# EAGLE design TubeScreamer (EAGLE 9.5.2)
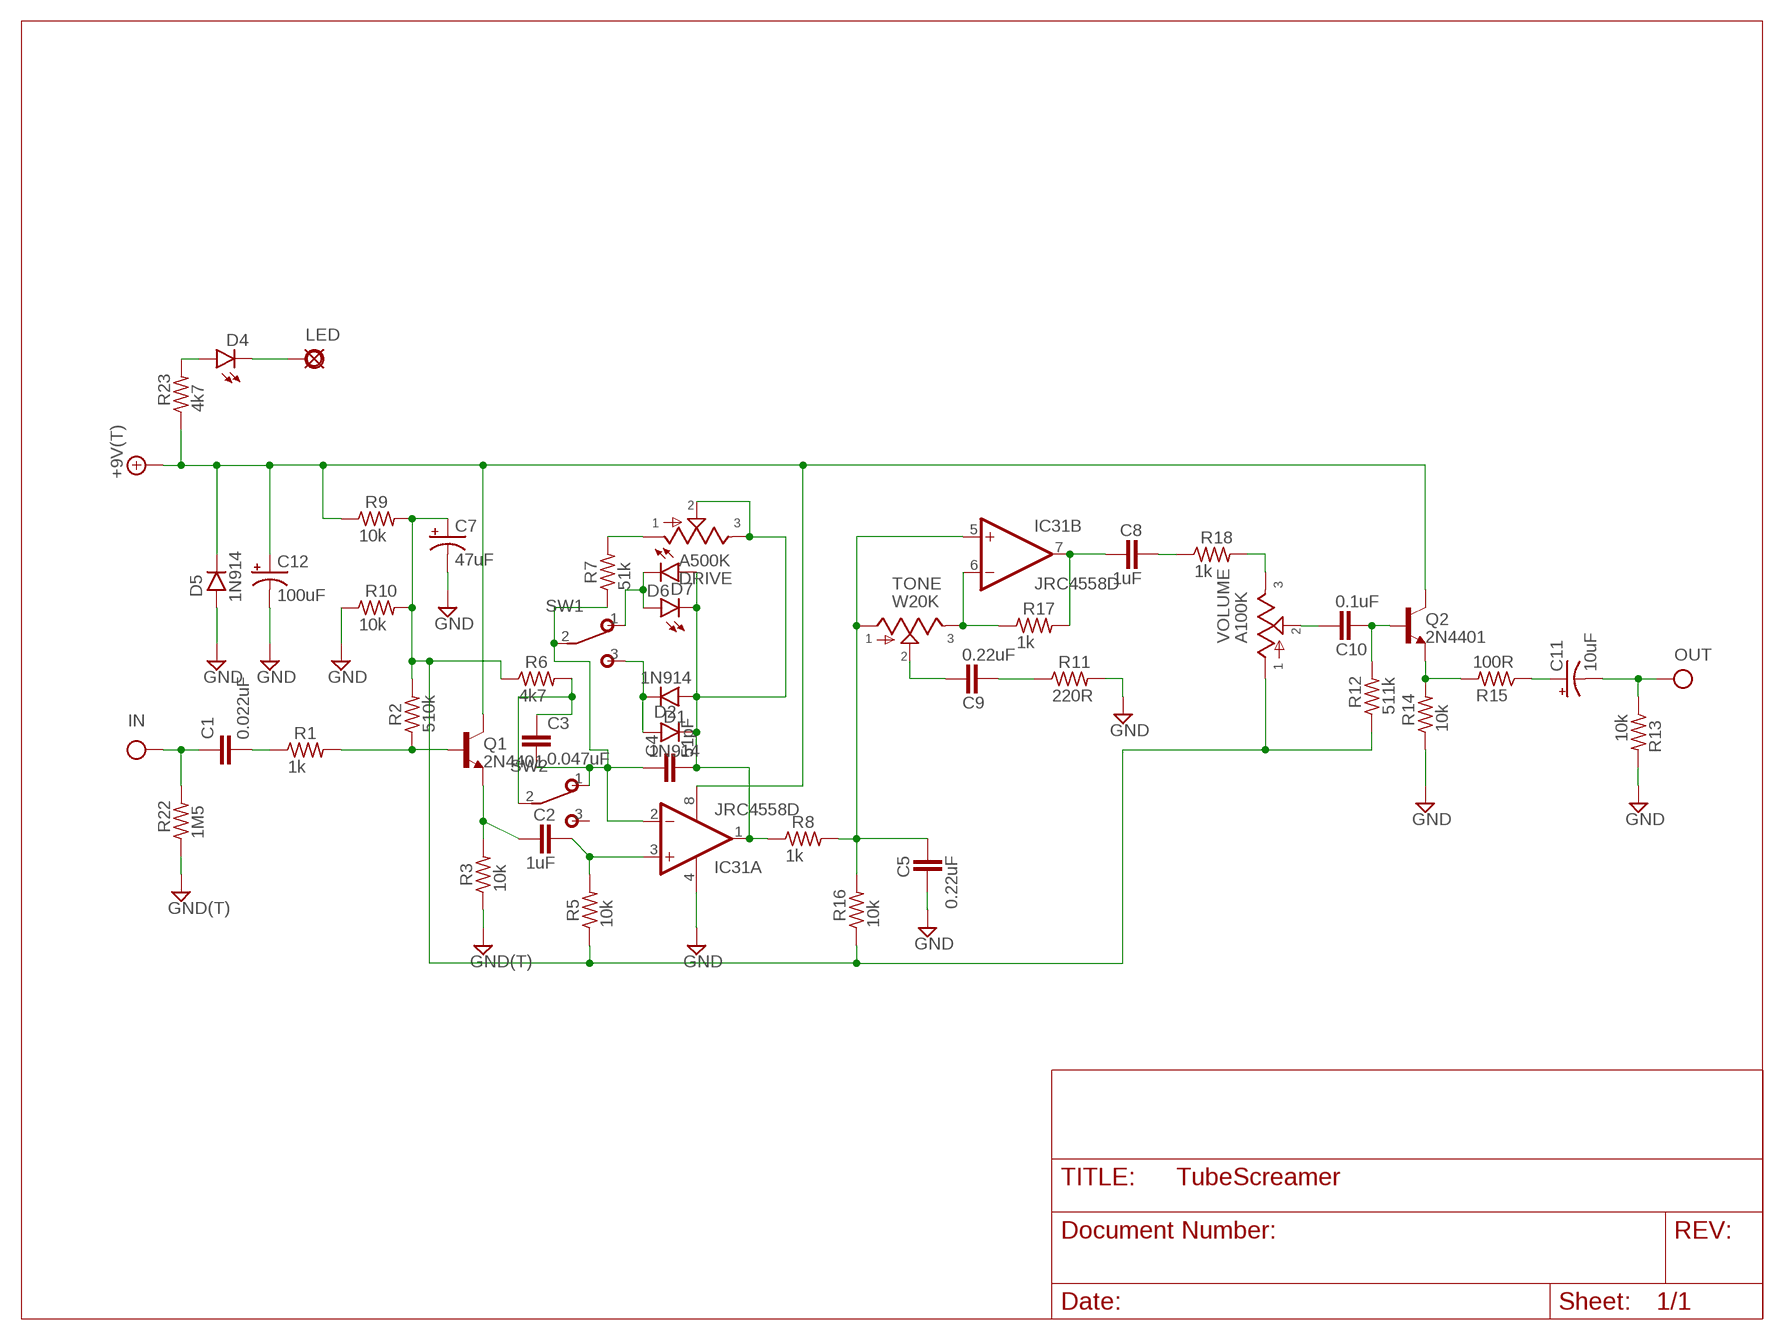
[diagram p0: schematic, sheet 1]

## Parts
+9V  +9V(T)  [SQUARE]
C1  0.022uF  070X0302  [070X030]
C2  1uF  072X0352  [072X035]
C3  0.047uF  070X0302  [070X030]
C4  51pF  050X030_0251  [050X030_025]
C5  0.22uF  072X0352  [072X035]
C7  47uF  0631  [063_025]
C8  1uF  072X0352  [072X035]
C9  0.22uF  072X0352  [072X035]
C10  0.1uF  072X0352  [072X035]
C11  10uF  0631  [063_025]
C12  100uF  080  [080_035]
D1  1N914  1N914.3  [DO35-3]
D2  1N914  1N914.3  [DO35-3]
D4  LED3MM  [LED3MM]
D5  1N914  1N914.3  [DO35-3]
D6  LED3MM  [LED3MM]
D7  LED3MM  [LED3MM]
DRIVE  A500K  POT16MM  [16MM]
GD2  GND(T)  [SQUARE]
GND  GND(T)  [SQUARE]
IC31  JRC4558D  LM4558N  [DIL08]
IN  IN(T)  [SQUARE]
LED  3mm  PAD  [SQUARE]
OUT  OUT(T)  [SQUARE]
Q1  2N4401  2N3904  [TO92-]
Q2  2N4401  2N3904  [TO92-]
R1  1k  6MM.3  [R0207/3]
R2  510k  6MM.3  [R0207/3]
R3  10k  6MM.3  [R0207/3]
R5  10k  6MM.3  [R0207/3]
R6  4k7  6MM.3  [R0207/3]
R7  51k  6MM.3  [R0207/3]
R8  1k  6MM.3  [R0207/3]
R9  10k  6MM.3  [R0207/3]
R10  10k  6MM.3  [R0207/3]
R11  220R  6MM.3  [R0207/3]
R12  511k  6MM.3  [R0207/3]
R13  10k  6MM.3  [R0207/3]
R14  10k  6MM.3  [R0207/3]
R15  100R  6MM.3  [R0207/3]
R16  10k  6MM.3  [R0207/3]
R17  1k  6MM.3  [R0207/3]
R18  1k  6MM.3  [R0207/3]
R22  1M5  6MM.3  [R0207/3]
R23  4k7  6MM.3  [R0207/3]
SW1  DIODES  SPDT  [M9040P]
SW2  FAT  SPDT  [M9040P]
TONE  W20K  POT16MM  [16MM]
VOLUME  A100K  POT16MM  [16MM]

## Nets
+9V: +9V.1(+9V) C12.+ D5.C IC31.8(P:V+) Q1.1(C) Q2.1(C) R9.1 R23.1
GND: C5.1 C7.- C12.- D5.A GD2.1(GND) GND.1(GND) IC31.4(P:V-) R3.1 R10.1 R11.2 R13.2 R14.1 R22.1
IN: C1.1 IN.1(IN) R22.2
N$1: C1.2 R1.1
N$2: Q1.2(B) R1.2 R2.1
N$3: D4.A R23.2
N$4: C2.1 Q1.3(E) R3.2
N$5: C7.+ R2.2 R5.1 R6.1 R9.2 R10.2 R12.1 R16.1 VOLUME.1
N$6: C2.2 IC31.3(A:+IN) R5.2
N$7: C4.2 D1.A D2.C D6.A D7.K(C) DRIVE.2 DRIVE.3 IC31.1(A:OUT) R8.1
N$8: C3.1 R6.2 SW2.2(P)
N$9: DRIVE.1 R7.2
N$10: C3.2 C4.1 IC31.2(A:-IN) R7.1 SW1.2(P) SW2.1(O)
N$11: C9.2 TONE.2
N$12: C5.2 IC31.5(B:+IN) R8.2 R16.2 TONE.1
N$13: C9.1 R11.1
N$14: IC31.6(B:-IN) R17.1 TONE.3
N$15: C8.1 IC31.7(B:OUT) R17.2
N$16: C8.2 R18.1
N$17: R18.2 VOLUME.3
N$18: C10.2 VOLUME.2
N$19: C10.1 Q2.2(B) R12.2
N$20: Q2.3(E) R14.2 R15.2
N$21: C11.+ R15.1
N$22: D4.K(C) LED.1(PAD)
N$24: D1.C D2.A SW1.3(S)
N$27: D6.K(C) D7.A SW1.1(O)
OUT: C11.- OUT.1(OUT) R13.1
Unconnected: SW2.3(S)

## Library data of the parts
+9V = mb_supply:+9V(T): +9V Voltage Supply use this to hook up +9v throughout a schematic instead of running wire automatically labels the net "+9v" adds a hookup pad to the circuit board
C1 C3 = mb_caps-chicklet:070X030: 0.0001 - .01uF (100 - 10,000pF) Panasonic ECQ-B 7mm x 3mm 50 or 63V: 0.0001 - .01uF (100 - 10,000pF);
C2 C5 C8-C10 = mb_caps-box:072X035: 0.15 - 1.0uF; WIMA MKP2 63, 100V: 0.047uF; MKS2 50V: 0.68 - 1.0uF; 63V: 0.33 - 0.47uF; 100V: 0.15 - 0.22uF;
C4 = mb_caps-ceramic:050X030_025: 47 - 120pF Xicon Ceramic Disc 2.5mm lead spacing
C7 C11 = mb_caps-electro:063: 33 - 220uF Xicon values at Mouser.com 10V: 220uF; 16V: 100uF; 25V: 100uF; 50V: 33uF
C12 = mb_caps-electro:080: 47 - 470uF Xicon values at Mouser.com 10V: 330, 470uF; 16V: 220, 330uF; 25V: 220uF; 50V: 47, 100uF
D1 D2 D5 = mb_diodes:1N914: Fast Switching Diode DO-35 glass case a.k.a. 1N4148
D4 D6 D7 = mb_diodes:LED
DRIVE TONE VOLUME = mb_pots:POT: Potentiometers the arrow indicates the clockwise motion of th wiper (lug 2) fully counter clockwise there is no resistance between lugs 1 and 2 fully clockwise the resistance between lugs 1 and 2 is the value of the pot
GD2 GND = mb_supply:GND(T): Ground use this to hook up ground (GND) throughout a schematic instead of running wire automatically labels the net "GND" adds a hookup pad to the circuit board (you can use several)
IC31 = mb_ics:*4558: *4558 Op Amp Infamous for its use in tube screamers. This op amp has many manufacturers, hence the leading "*" in the name. The JRC4558 is a widely used example.
IN = mb_supply:IN(T): Input obsolete: use Pad instead and label net shematic input label with circuit board terminal/pad generally used only once on a schematic (because this device labels the net "IN" in the same way as a voltage supply or ground net)
LED = mb_supply:PAD: PAD use this package for pads with any purpose, including input, output, send or return various pad shapes: round, square, octogonal, long, and long offset
OUT = mb_supply:OUT(T): Output obsolete: use Pad instead and label net output label with circuit board terminal/pad usually appears only once on a schematic
Q1 Q2 = mb_trans:2N3904: NPN Transistor
R1-R3 R5-R18 R22 R23 = mb_resistors:6MM: 6mm Resistors Leads spaced 1-6 holes apart for 0.1" perfboard. Suitable for 1/4 watt resistors.
SW1 SW2 = mb_switches:SPDT: TOGGLE SWITCH Marquardt

## Board
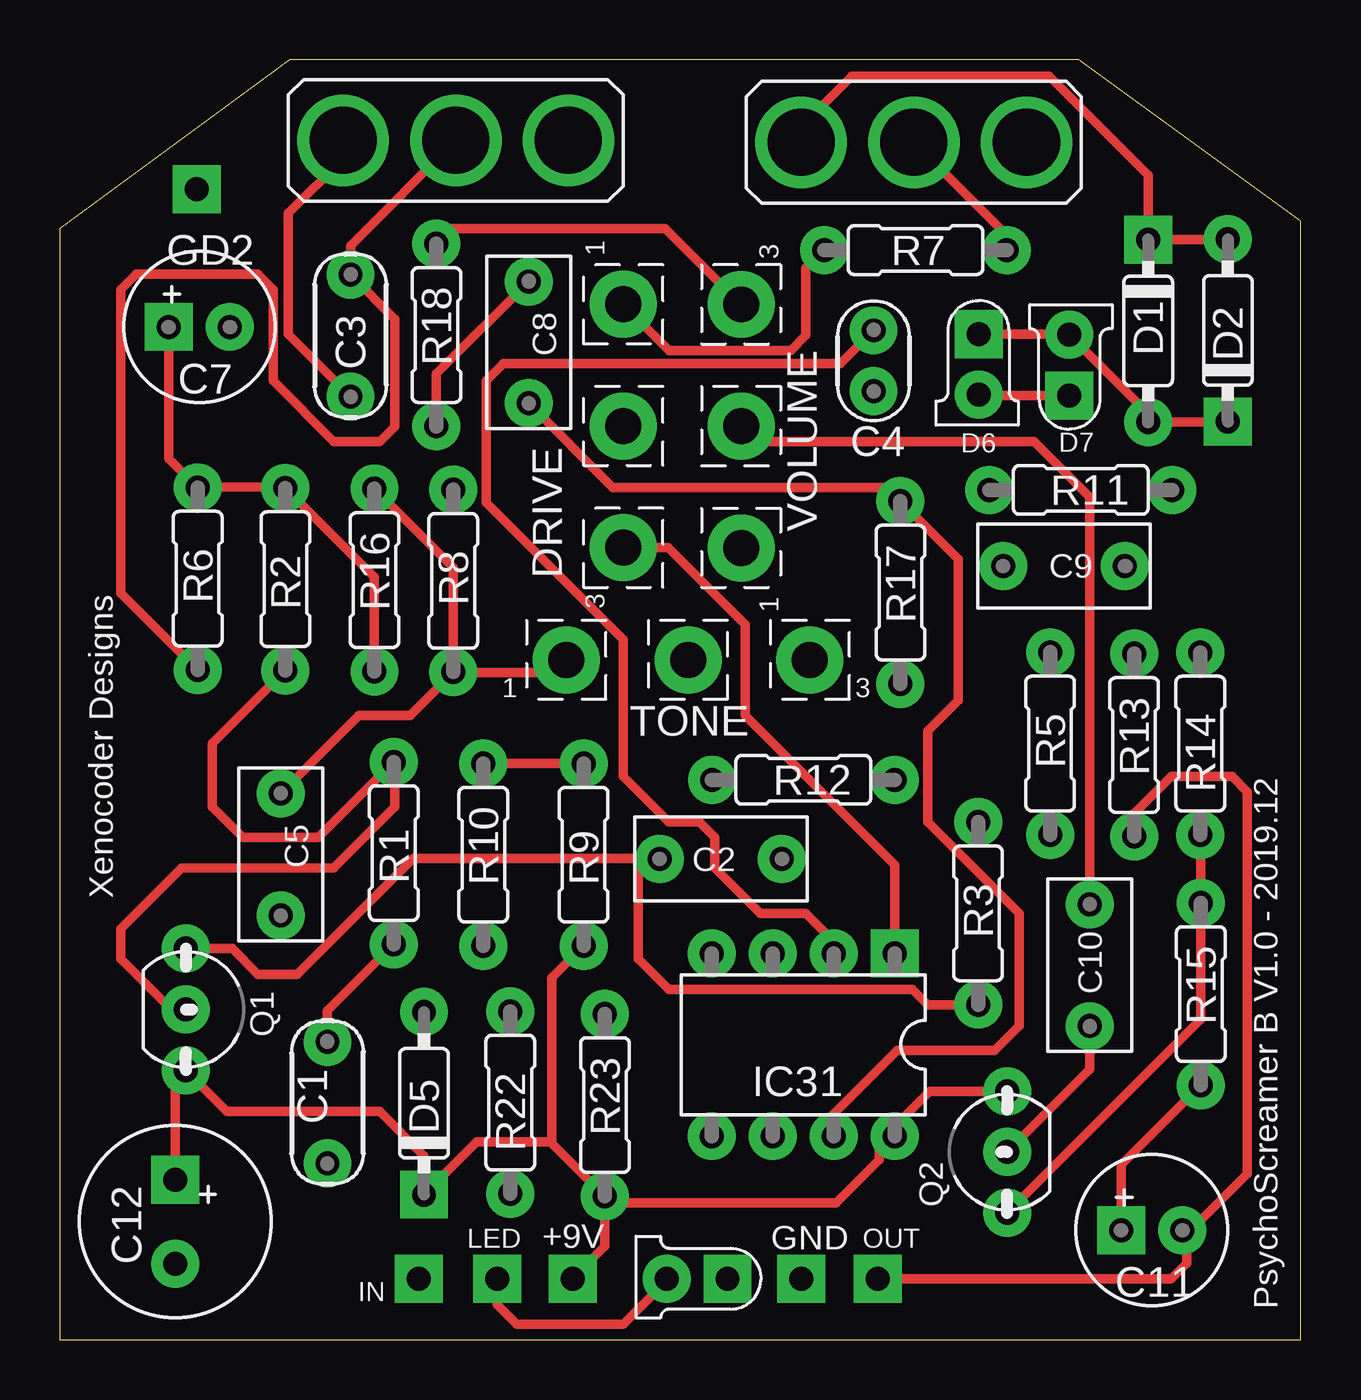
[diagram p1: board, top side]
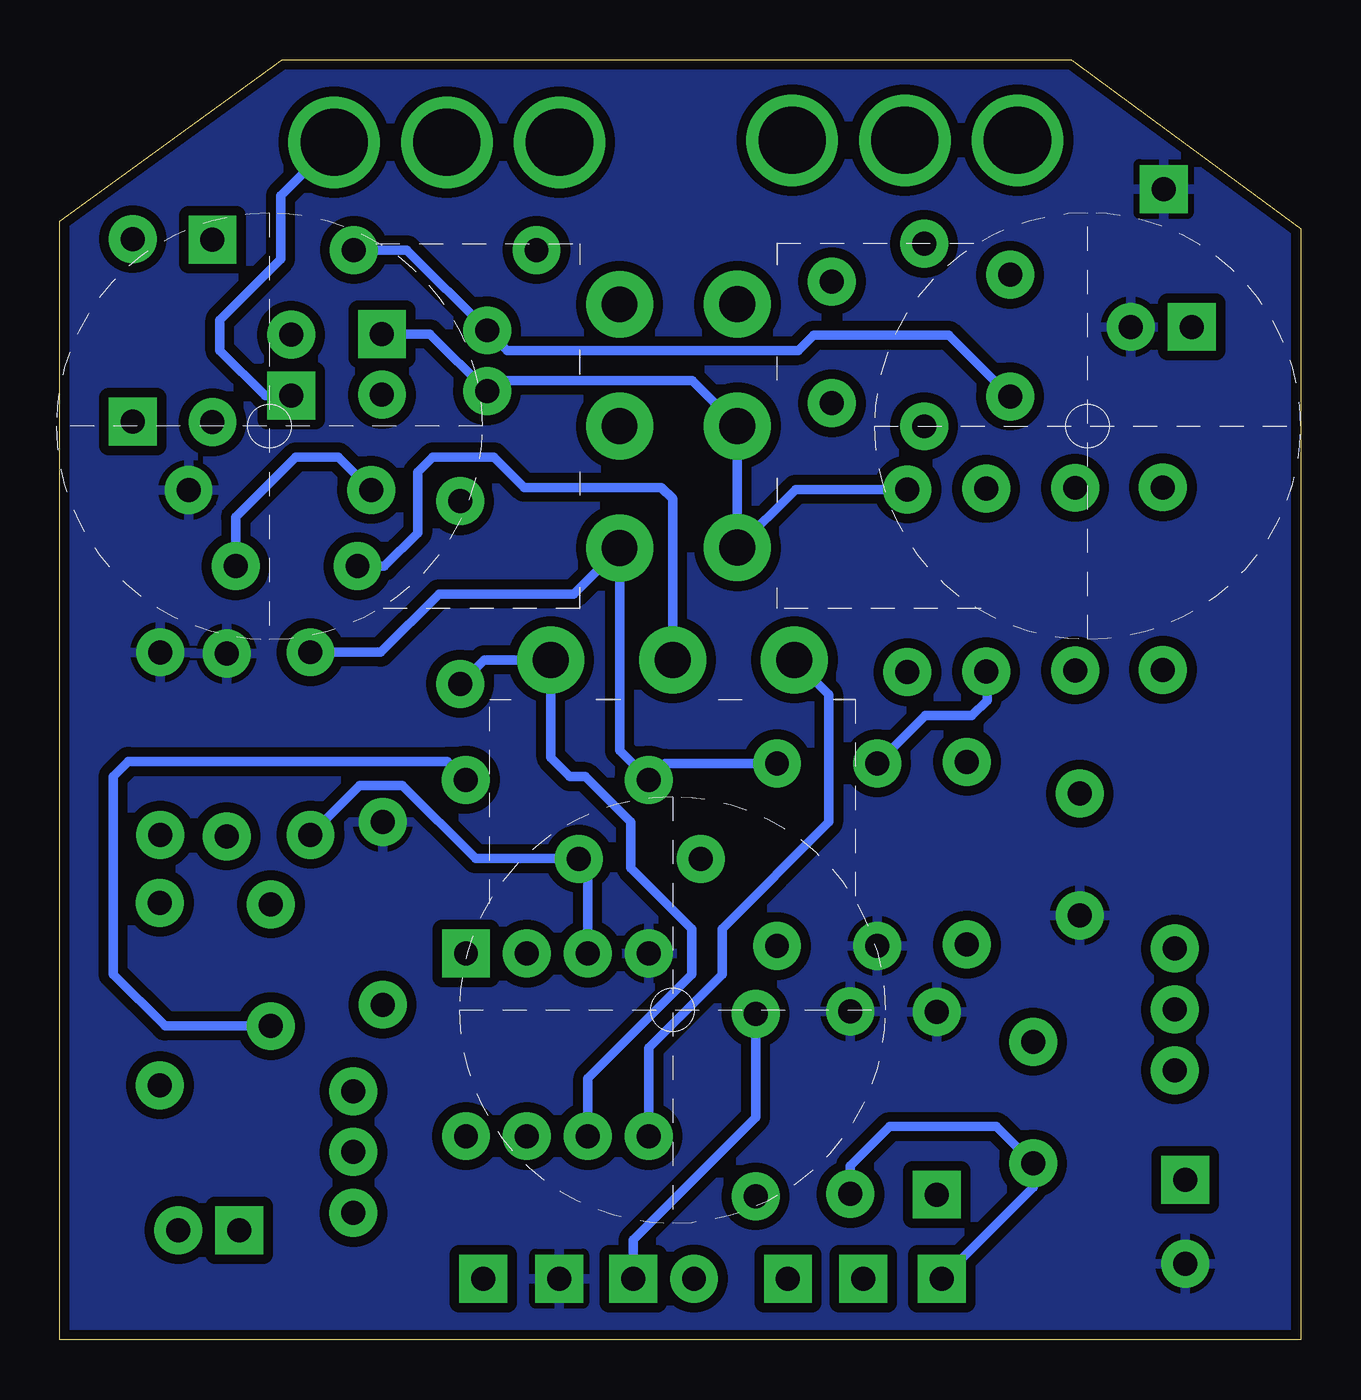
[diagram p2: board, bottom side, seen from below]

Size 51.75 x 53.4 mm. Coordinates in mm from the lower left corner, seen from the top.
Outline: 0,0 51.75,0 51.75,46.67 42.49,53.4 9.58,53.4 0,46.35 0,0
Copper layers (1*16): Top 0.0356mm / dielectric 1.5011mm / Bottom 0.0356mm
Design rules "LaenPCBOrder": minimum track width 6mil, minimum drill 13mil, track to track 6mil, track to pad 6mil, pad to pad 6mil, via to via 6mil, smd to smd 6mil, copper to edge 15mil, drill to drill 6mil, minimum pad ring 7mil, minimum via ring 7mil, stop-mask expansion 3mil, vias tented up to drill 0mil, thermal gap 10mil

### Footprints (pad centres in the part's own frame; a part is rotated, then mirrored left to right if it is on the bottom)
SQUARE = drill 1 pad 2 square: 1 0,0
070X030 = drill 1 pad 2: 1 -2.54,0; 2 2.54,0
072X035 = drill 1 pad 2: 1 -2.54,0; 2 2.54,0
050X030_025 = drill 1 pad 2: 1 -1.27,0; 2 1.27,0
063_025 = drill 1 pad 2 square: + -1.27,0 | drill 1 pad 2: - 1.27,0
080_035 = drill 1 pad 2 square: + -1.75,0 | drill 1 pad 2: - 1.75,0
DO35-3 = drill 1 pad 2: A 3.81,0 | drill 1 pad 2 square: C -3.81,0
LED3MM = drill 1 pad 2 square: A -1.27,0 | drill 1 pad 2: K 1.27,0
16MM = drill 1.5 pad 2.794: 1 5.08,0; 2 0,0; 3 -5.08,0
DIL08 = drill 1 pad 2 square: 1 -3.81,-3.81 | drill 1 pad 2: 2 -1.27,-3.81; 3 1.27,-3.81; 4 3.81,-3.81; 5 3.81,3.81; 6 1.27,3.81; 7 -1.27,3.81; 8 -3.81,3.81
TO92- = drill 1 pad 2: 1 2.54,0; 2 0,0; 3 -2.54,0
R0207/3 = drill 1 pad 2: 1 -3.81,0; 2 3.81,0
M9040P = drill 2.8 pad 3.81: 1 0,4.699; 2 0,0; 3 0,-4.699

### Placement (x,y rotation side)
+9V  21.39,2.54 0 top
C1  11.16,9.89 90 top
C2  27.57,20.06 0 top
C3  12.12,41.89 270 top
C4  33.94,40.84 270 top
C5  9.21,20.25 90 top
C7  5.82,42.26 0 top
C8  19.55,41.61 90 top
C9  41.88,32.27 180 top
C10  42.95,15.62 90 top
C11  45.54,4.57 0 top
C12  4.81,4.92 270 top
D1  45.39,42.09 270 top
D2  48.72,42.1 90 top
D4  26.57,2.54 180 top
D5  15.19,9.86 90 top
D6  38.32,40.69 270 top
D7  42.11,40.65 90 top
DRIVE  23.49,38.12 90 top
GD2  5.71,48.01 0 top
GND  30.93,2.54 0 top
IC31  31,12.3 180 top
IN  14.97,2.54 0 top
LED  18.24,2.54 0 top
OUT  34.1,2.54 0 top
Q1  5.25,13.78 270 top
Q2  39.51,7.83 90 top
R1  13.93,20.3 90 top
R2  9.4,31.73 90 top
R3  38.3,17.79 270 top
R5  41.3,24.87 270 top
R6  5.75,31.75 270 top
R7  35.69,45.46 180 top
R8  16.41,31.66 270 top
R9  21.84,20.23 90 top
R10  17.66,20.23 90 top
R11  42.58,35.45 0 top
R12  31.01,23.36 0 top
R13  44.8,24.81 90 top
R14  47.56,24.87 270 top
R15  47.59,14.42 90 top
R16  13.12,31.69 90 top
R17  35.06,31.17 90 top
R18  15.71,41.91 90 top
R22  18.78,9.89 270 top
R23  22.73,9.79 90 top
SW1  35.62,49.96 270 top
SW2  16.51,50.04 90 top
TONE  26.2,28.36 180 top
VOLUME  28.41,38.11 270 top

### Tracks (layer width: path | path; a pad name or v marks a point on that pad's centre or on a via)
+9V
  Top 0.406: +9V.1 22.73,3.89 R23.1 | 20.52,8.2 20.45,8.26 17.39,8.26 D5.C 15.19,7.67 13.34,9.53 6.96,9.53 Q1.1 4.81,10.79 C12.+ | 20.52,8.2 R23.1 | R23.1 23,5.71 32.38,5.71 34.18,7.51 34.18,8.26 34.81,8.89 | 34.81,8.89 IC31.8 | Q2.1 36.29,10.37 34.81,8.89 | R9.1 20.52,15.1 20.52,8.2
GND
  pour Bottom (isolate 0.406): 0,0 0,48.9 0.64,49.53 4.45,53.34 9.53,53.34 43.81,53.34 45.09,53.34 52.07,46.35 52.07,0
IN
  Bottom 0.406: IN.1 11.16,6.35 C1.1 12.7,8.89 17.14,8.89 18.78,7.25 R22.2
N$1
  Top 0.406: C1.2 11.16,13.72 R1.1
N$2
  Top 0.406: R2.1 6.35,24.86 6.35,22.23 7.62,20.95 10.77,20.95 R1.2 13.97,24.06 13.97,22.23 11.43,19.68 5.08,19.68 2.54,17.14 2.54,15.88 4.64,13.78 Q1.2
N$3
  Bottom 0.406: D4.A 27.84,4.16 22.73,9.27 R23.2
N$4
  Top 0.406: Q1.3 7.18,16.32 8.26,15.24 9.91,15.24 14.73,20.07 24.13,20.07 | 24.13,20.07 C2.1 | R3.2 36.19,13.97 35.56,14.61 25.4,14.61 24.13,15.88 24.13,20.07
N$5
  Top 0.406: R6.1 5.73,35.58 | 5.73,35.58 4.54,36.76 C7.+ | 5.73,35.58 9.37,35.58 R2.2 13.12,31.82 R16.1 | R10.2 R9.2
  Bottom 0.406: R10.2 15.67,26.04 13.72,26.04 13.08,26.67 13.08,27.84 R16.1 | R9.2 26.51,24.04 R12.1 28.41,24.57 VOLUME.1 30.33,31.11 35.94,31.11 38.38,28.68 R5.1
N$6
  Bottom 0.406: IC31.3 29.73,19.68 C2.2 34.42,20.07 37.47,23.11 39.25,23.11 R5.2
N$7
  Top 0.406: D2.C 48.7,38.27 D1.A 45.39,38.64 D7.K 42.07,41.96 D6.A | IC31.1 34.81,19.8 28.57,26.04 28.57,29.84 25.38,33.04 DRIVE.3
  Bottom 0.406: D6.A 36.33,41.96 C4.2 33.5,40.01 25.38,40.01 DRIVE.2 DRIVE.3 21.07,35.47 R8.1
N$8
  Top 0.406: SW2.2 12.12,45.65 C3.1 13.97,42.58 13.97,38.1 13.34,37.47 11.43,37.47 8.89,40.01 8.89,43.81 8.26,44.45 3.17,44.45 2.54,43.81 2.54,31.14 R6.2
N$9
  Top 0.406: DRIVE.1 25.42,41.27 30.48,41.27 31.11,41.91 31.11,44.7 R7.2
N$10
  Top 0.406: SW2.1 11.81,49.28 9.53,46.99 9.53,41.95 C3.2 | SW1.2 39.49,46.08 R7.1 | IC31.2 32.27,16.62 31.11,17.78 29.21,17.78 27.3,19.68 27.3,20.95 26.67,21.59 25.4,21.59 23.5,23.5 23.5,29.21 17.78,34.92 17.78,40.01 18.49,40.72 32.54,40.72 C4.1
  Bottom 0.406: R7.1 37.28,45.46 C4.1 33.1,41.27 20.95,41.27 20.32,41.91 14.68,41.91 C3.2
N$11
  Bottom 0.406: TONE.2 26.2,35.09 26.67,35.56 32.38,35.56 33.66,36.83 36.2,36.83 36.83,36.2 36.83,33.66 38.22,32.27 C9.2
N$12
  Top 0.406: R16.2 16.41,32.22 R8.2 16.41,27.84 | C5.2 12.46,26.04 14.61,26.04 16.41,27.84 | TONE.1 20.59,27.84 16.41,27.84
  Bottom 0.406: TONE.1 19.68,26.93 19.68,21.59 24.13,17.14 24.13,15.24 27.2,12.18 IC31.5
N$13
  Bottom 0.406: R11.1 40.15,36.83 41.91,36.83 44.42,34.32 C9.1
N$14
  Bottom 0.406: IC31.6 29.73,10.9 25.4,15.24 25.4,17.14 27.94,19.68 27.94,21.59 29.84,23.5 30.48,23.5 31.28,24.3 TONE.3 34.06,28.36 R17.1
N$15
  Top 0.406: C8.1 23.07,35.56 34.48,35.56 R17.2 37.47,32.57 37.47,26.67 36.2,25.4 36.2,21.59 40.01,17.78 40.01,13.08 38.99,12.06 34.92,12.06 32.27,9.41 IC31.7
N$16
  Top 0.406: R18.1 15.71,40.3 C8.2
N$17
  Top 0.406: R18.2 16.34,46.35 25.25,46.35 VOLUME.3
N$18
  Top 0.406: C10.2 42.95,35.16 40.64,37.47 29.06,37.47 VOLUME.2
N$19
  Top 0.406: Q2.2 42.95,11.27 C10.1
  Bottom 0.406: C10.1 47.37,13.08 49.53,15.24 49.53,23.5 48.9,24.13 35.59,24.13 R12.2
N$20
  Top 0.406: Q2.3 47.59,13.36 R15.2 47.59,21.04 R14.2
N$21
  Top 0.406: C11.+ 44.27,7.29 R15.1
N$22
  Top 0.406: LED.1 18.24,1.45 19.05,0.64 23.5,0.64 25.3,2.44 D4.K
N$24
  Top 0.406: SW1.3 30.92,50.6 33.02,52.7 41.27,52.7 45.39,48.59 D1.C 48.7,45.9 D2.A
N$27
  Top 0.406: D7.A 38.36,39.38 D6.K
  Bottom 0.406: D7.A 43.19,39.38 45.09,41.27 45.09,42.55 42.55,45.09 42.55,47.73 SW1.1
OUT
  Top 0.406: OUT.1 46.36,2.54 46.99,3.17 46.99,4.38 | 46.99,4.38 C11.- | R13.1 44.8,21.94 46.35,23.5 48.9,23.5 49.53,22.86 49.53,6.92 46.99,4.38

### Text on the board
tNames: Xenocoder Designs | PsychoScreamer B V1.0 - 2019.12